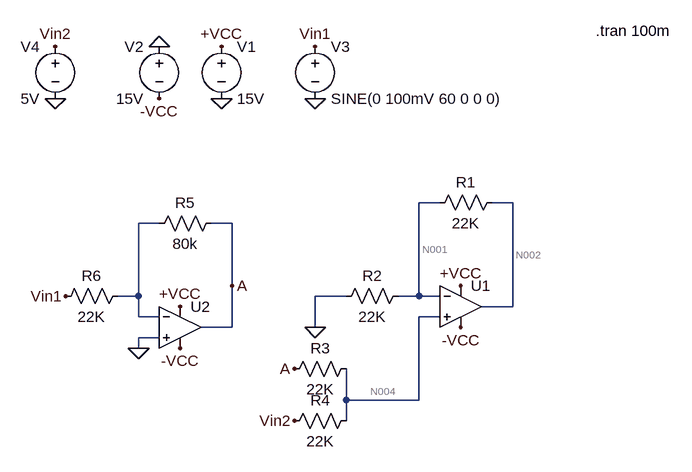
[diagram p0: schematic OpAmpSomaNInversor.asc]
OpAmpSomaNInversor.asc, the LTspice schematic file:
Version 4
SHEET 1 880 680
WIRE -144 96 -176 96
WIRE -32 96 -64 96
WIRE -576 128 -608 128
WIRE -464 128 -496 128
WIRE -464 224 -464 128
WIRE -608 240 -608 128
WIRE -608 240 -640 240
WIRE -288 240 -336 240
WIRE -176 240 -176 96
WIRE -176 240 -208 240
WIRE -144 240 -176 240
WIRE -32 256 -32 96
WIRE -32 256 -80 256
WIRE -608 272 -608 240
WIRE -576 272 -608 272
WIRE -144 272 -176 272
WIRE -464 288 -464 224
WIRE -464 288 -512 288
WIRE -336 288 -336 240
WIRE -576 304 -608 304
WIRE -608 320 -608 304
WIRE -288 400 -288 352
WIRE -176 400 -176 272
WIRE -176 400 -288 400
WIRE -288 432 -288 400
FLAG -480 -144 +VCC
FLAG -576 -64 -VCC
FLAG -480 -64 0
FLAG -112 224 +VCC
FLAG -336 -64 0
FLAG -336 -144 Vin1
FLAG -576 -144 0
FLAG -336 288 0
FLAG -368 432 Vin2
FLAG -544 256 +VCC
FLAG -720 240 Vin1
FLAG -544 320 -VCC
FLAG -464 224 A
FLAG -368 352 A
FLAG -112 288 -VCC
FLAG -736 -64 0
FLAG -736 -144 Vin2
FLAG -608 320 0
SYMBOL Opamps\\UniversalOpamp2 -112 256 R0
SYMATTR InstName U1
SYMBOL voltage -480 -160 R0
WINDOW 123 0 0 Left 2
SYMATTR SpiceLine Rser=1m
SYMATTR InstName V1
SYMATTR Value 15V
SYMBOL voltage -576 -160 M0
WINDOW 123 0 0 Left 2
SYMATTR SpiceLine Rser=1m
SYMATTR InstName V2
SYMATTR Value 15V
SYMBOL res -160 112 R270
WINDOW 0 32 56 VTop 2
WINDOW 3 0 56 VBottom 2
SYMATTR InstName R1
SYMATTR Value 22K
SYMATTR SpiceLine tol=1 pwr=0.1
SYMBOL voltage -336 -160 R0
WINDOW 123 0 0 Left 2
SYMATTR SpiceLine Rser=1m
SYMATTR InstName V3
SYMATTR Value SINE(0 100mV 60 0 0 0)
SYMBOL Opamps\\UniversalOpamp2 -544 288 R0
SYMATTR InstName U2
SYMBOL res -592 144 R270
WINDOW 0 32 56 VTop 2
WINDOW 3 0 56 VBottom 2
SYMATTR InstName R5
SYMATTR Value 80k
SYMATTR SpiceLine tol=1 pwr=0.1
SYMBOL res -304 256 R270
WINDOW 0 32 56 VTop 2
WINDOW 3 0 56 VBottom 2
SYMATTR InstName R2
SYMATTR Value 22K
SYMATTR SpiceLine tol=1 pwr=0.1
SYMBOL res -384 368 R270
WINDOW 0 32 56 VTop 2
WINDOW 3 0 56 VBottom 2
SYMATTR InstName R3
SYMATTR Value 22K
SYMATTR SpiceLine tol=1 pwr=0.1
SYMBOL res -384 448 R270
WINDOW 0 32 56 VTop 2
WINDOW 3 0 56 VBottom 2
SYMATTR InstName R4
SYMATTR Value 22K
SYMATTR SpiceLine tol=1 pwr=0.1
SYMBOL res -736 256 R270
WINDOW 0 32 56 VTop 2
WINDOW 3 0 56 VBottom 2
SYMATTR InstName R6
SYMATTR Value 22K
SYMATTR SpiceLine tol=1 pwr=0.1
SYMBOL voltage -736 -160 M0
WINDOW 123 0 0 Left 2
SYMATTR SpiceLine Rser=1m
SYMATTR InstName V4
SYMATTR Value 5V
TEXT 96 -168 Left 2 !.tran 100m

The netlist it stands for:
* OpAmpSomaNInversor.asc
XU1 N004 N001 +VCC -VCC N002 level.2 Avol=1Meg GBW=10Meg Slew=10Meg ilimit=25m rail=0 Vos=0 phimargin=45 en=0 enk=0 in=0 ink=0 Rin=500Meg  ; pins IN+ IN- V+ V- OUT
V1 +VCC 0 15V Rser=1m
V2 0 -VCC 15V Rser=1m
R1 N001 N002 22K tol=1 pwr=0.1
V3 Vin1 0 SINE(0 100mV 60 0 0 0) Rser=1m
XU2 0 N003 +VCC -VCC A level.2 Avol=1Meg GBW=10Meg Slew=10Meg ilimit=25m rail=0 Vos=0 phimargin=45 en=0 enk=0 in=0 ink=0 Rin=500Meg  ; pins IN+ IN- V+ V- OUT
R5 N003 A 80k tol=1 pwr=0.1
R2 0 N001 22K tol=1 pwr=0.1
R3 A N004 22K tol=1 pwr=0.1
R4 Vin2 N004 22K tol=1 pwr=0.1
R6 Vin1 N003 22K tol=1 pwr=0.1
V4 Vin2 0 5V Rser=1m
.tran 100m
.lib UniversalOpamps2.sub
.backanno
.end

* Results of the author's LTspice run, read from the files saved beside the schematic
* Operating Point, zero values left out:
*   V(n002) = 5 V
*   V(+vcc) = 15 V
*   V(-vcc) = -15 V
*   V(n001) = 2.5 V
*   V(n004) = 2.5 V
*   V(vin2) = 5 V
*   I(R4) = 113.6 µA
*   I(R3) = -113.6 µA
*   I(R2) = -113.6 µA
*   I(R1) = -113.6 µA
*   I(V4) = -113.6 µA
*   I(V2) = -2.913 mA
*   I(V1) = -2.913 mA
*   Ix(u1:1) = 5 nA
*   Ix(u1:2) = 5 nA
*   Ix(u1:3) = 1.471 mA
*   Ix(u1:4) = -1.357 mA
*   Ix(u1:5) = -113.6 µA
*   Ix(u2:3) = 1.443 mA
*   Ix(u2:4) = -1.556 mA
*   Ix(u2:5) = 113.6 µA
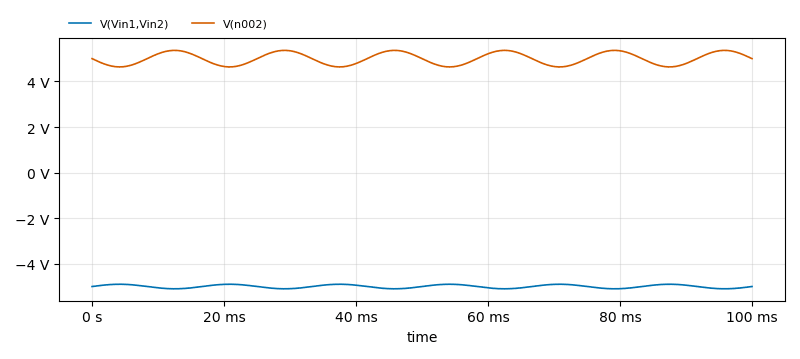
[diagram p1: Transient Analysis of OpAmpSomaNInversor.asc, plotted from the saved traces]
* Transient Analysis, 1 run:
*   V(Vin1,Vin2): min -5.1 V, max -4.9 V, average -5 V, rms 5 V, last -5 V
*   V(n002): min 4.637 V, max 5.363 V, average 5 V, rms 5.007 V, last 5 V